# Altium project MB_ANALOG.PrjPCB
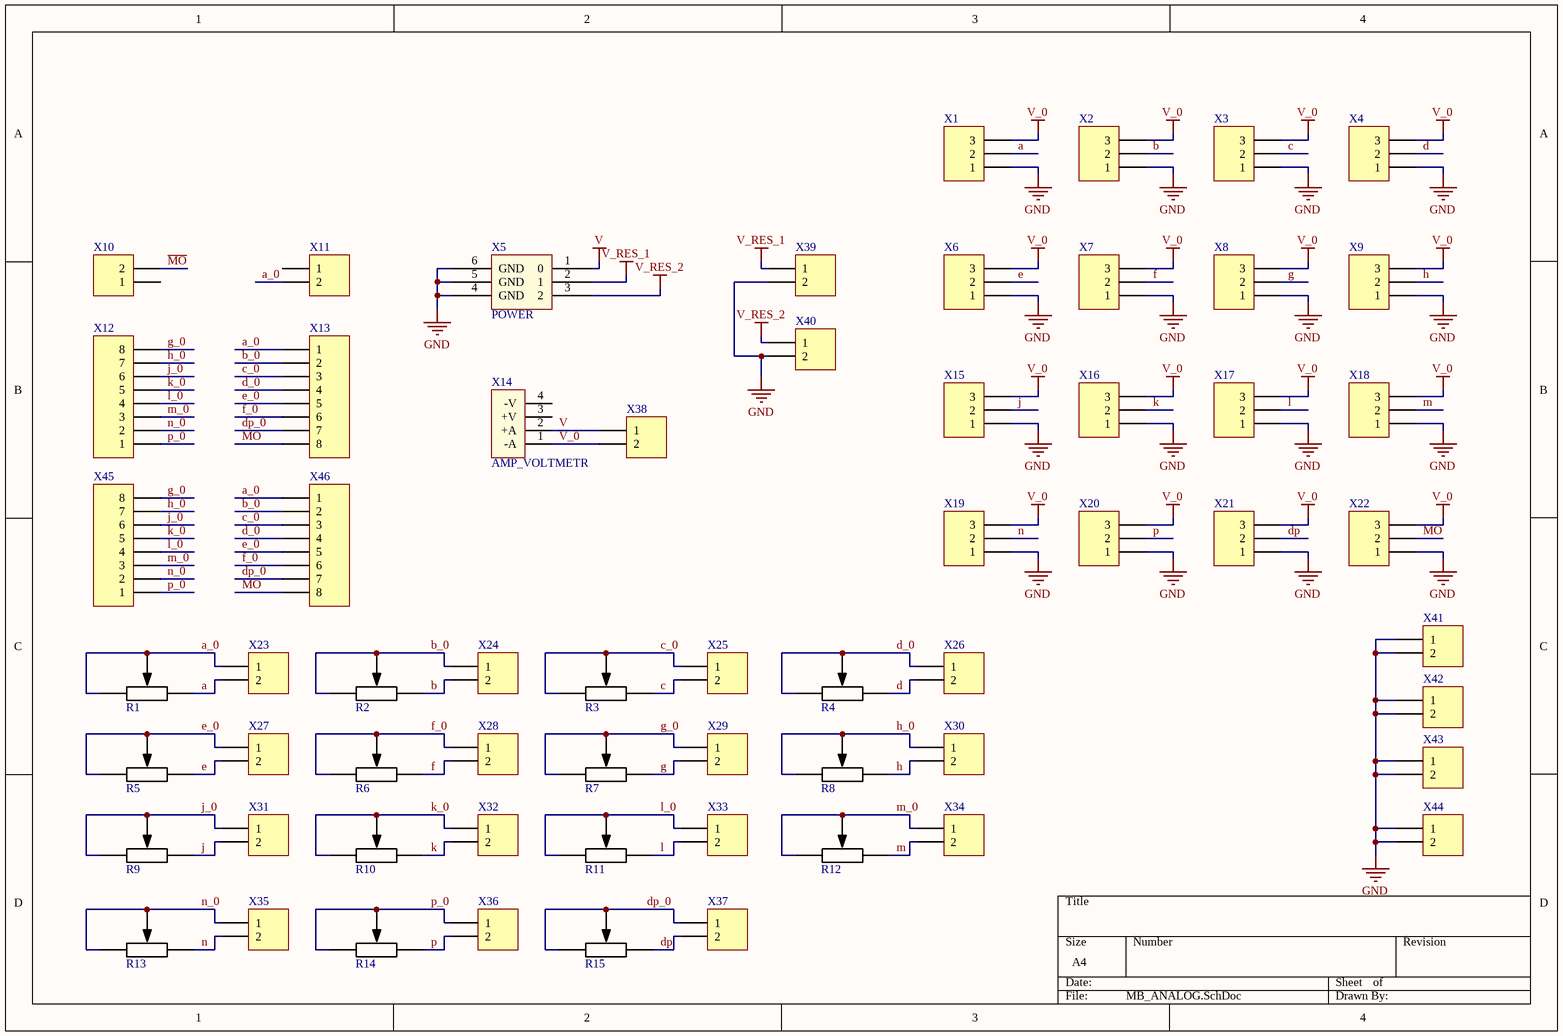
[diagram p0: MB_ANALOG.SchDoc]
1 sheet, 61 parts. Net scope: global (net labels, ports and power ports of the same name join across sheets).
Board file: MB_ANALOG.PcbDoc

## Sheet MB_ANALOG.SchDoc
size A4

### Parts
R1  RES 3266W  [RES 3266W]  (value not drawn)
R2  RES 3266W  [RES 3266W]  (value not drawn)
R3  RES 3266W  [RES 3266W]  (value not drawn)
R4  RES 3266W  [RES 3266W]  (value not drawn)
R5  RES 3266W  [RES 3266W]  (value not drawn)
R6  RES 3266W  [RES 3266W]  (value not drawn)
R7  RES 3266W  [RES 3266W]  (value not drawn)
R8  RES 3266W  [RES 3266W]  (value not drawn)
R9  RES 3266W  [RES 3266W]  (value not drawn)
R10  RES 3266W  [RES 3266W]  (value not drawn)
R11  RES 3266W  [RES 3266W]  (value not drawn)
R12  RES 3266W  [RES 3266W]  (value not drawn)
R13  RES 3266W  [RES 3266W]  (value not drawn)
R14  RES 3266W  [RES 3266W]  (value not drawn)
R15  RES 3266W  [RES 3266W]  (value not drawn)
X1  Header 3  [HDR1X3]  (value not drawn)
X2  Header 3  [HDR1X3]  (value not drawn)
X3  Header 3  [HDR1X3]  (value not drawn)
X4  Header 3  [HDR1X3]  (value not drawn)
X5  POWER  [POWER]
X6  Header 3  [HDR1X3]  (value not drawn)
X7  Header 3  [HDR1X3]  (value not drawn)
X8  Header 3  [HDR1X3]  (value not drawn)
X9  Header 3  [HDR1X3]  (value not drawn)
X10  Header 2  [HDR1X2]  (value not drawn)
X11  Header 2  [HDR1X2]  (value not drawn)
X12  Header 8  [HDR1X8]  (value not drawn)
X13  Header 8  [HDR1X8]  (value not drawn)
X14  AMP_VOLTMETR  [AMP_VOLTMETR]
X15  Header 3  [HDR1X3]  (value not drawn)
X16  Header 3  [HDR1X3]  (value not drawn)
X17  Header 3  [HDR1X3]  (value not drawn)
X18  Header 3  [HDR1X3]  (value not drawn)
X19  Header 3  [HDR1X3]  (value not drawn)
X20  Header 3  [HDR1X3]  (value not drawn)
X21  Header 3  [HDR1X3]  (value not drawn)
X22  Header 3  [HDR1X3]  (value not drawn)
X23  Header 2  [HDR1X2]  (value not drawn)
X24  Header 2  [HDR1X2]  (value not drawn)
X25  Header 2  [HDR1X2]  (value not drawn)
X26  Header 2  [HDR1X2]  (value not drawn)
X27  Header 2  [HDR1X2]  (value not drawn)
X28  Header 2  [HDR1X2]  (value not drawn)
X29  Header 2  [HDR1X2]  (value not drawn)
X30  Header 2  [HDR1X2]  (value not drawn)
X31  Header 2  [HDR1X2]  (value not drawn)
X32  Header 2  [HDR1X2]  (value not drawn)
X33  Header 2  [HDR1X2]  (value not drawn)
X34  Header 2  [HDR1X2]  (value not drawn)
X35  Header 2  [HDR1X2]  (value not drawn)
X36  Header 2  [HDR1X2]  (value not drawn)
X37  Header 2  [HDR1X2]  (value not drawn)
X38  Header 2  [HDR1X2]  (value not drawn)
X39  Header 2  [HDR1X2]  (value not drawn)
X40  Header 2  [HDR1X2]  (value not drawn)
X41  Header 2  [HDR1X2]  (value not drawn)
X42  Header 2  [HDR1X2]  (value not drawn)
X43  Header 2  [HDR1X2]  (value not drawn)
X44  Header 2  [HDR1X2]  (value not drawn)
X45  Header 8  [HDR1X8]  (value not drawn)
X46  Header 8  [HDR1X8]  (value not drawn)

### Nets
GND: X1.1 X2.1 X3.1 X4.1 X5.4(GND) X5.5(GND) X5.6(GND) X6.1 X7.1 X8.1 X9.1 X15.1 X16.1 X17.1 X18.1 X19.1 X20.1 X21.1 X22.1 X39.2 X40.2 X41.1 X41.2 X42.1 X42.2 X43.1 X43.2 X44.1 X44.2
V: X5.1(0) X14.2(+A) X38.1
V_0: X1.3 X2.3 X3.3 X4.3 X6.3 X7.3 X8.3 X9.3 X14.1(-A) X15.3 X16.3 X17.3 X18.3 X19.3 X20.3 X21.3 X22.3 X38.2
V_RES_1: X5.2(1) X39.1
V_RES_2: X5.3(2) X40.1
a: R1.3 X1.2 X23.2
a_0: R1.1 R1.2 X11.2 X13.1 X23.1 X46.1
b: R2.3 X2.2 X24.2
b_0: R2.1 R2.2 X13.2 X24.1 X46.2
c: R3.3 X3.2 X25.2
c_0: R3.1 R3.2 X13.3 X25.1 X46.3
d: R4.3 X4.2 X26.2
d_0: R4.1 R4.2 X13.4 X26.1 X46.4
dp: R15.3 X21.2 X37.2
dp_0: R15.1 R15.2 X13.7 X37.1 X46.7
e: R5.3 X6.2 X27.2
e_0: R5.1 R5.2 X13.5 X27.1 X46.5
f: R6.3 X7.2 X28.2
f_0: R6.1 R6.2 X13.6 X28.1 X46.6
g: R7.3 X8.2 X29.2
g_0: R7.1 R7.2 X12.8 X29.1 X45.8
h: R8.3 X9.2 X30.2
h_0: R8.1 R8.2 X12.7 X30.1 X45.7
j: R9.3 X15.2 X31.2
j_0: R9.1 R9.2 X12.6 X31.1 X45.6
k: R10.3 X16.2 X32.2
k_0: R10.1 R10.2 X12.5 X32.1 X45.5
l: R11.3 X17.2 X33.2
l_0: R11.1 R11.2 X12.4 X33.1 X45.4
m: R12.3 X18.2 X34.2
~{MO}: X10.2 X13.8 X22.2 X46.8
m_0: R12.1 R12.2 X12.3 X34.1 X45.3
n: R13.3 X19.2 X35.2
n_0: R13.1 R13.2 X12.2 X35.1 X45.2
p: R14.3 X20.2 X36.2
p_0: R14.1 R14.2 X12.1 X36.1 X45.1

Not connected (* = marked no-connect by the designer): X10 1; X11 1; X14 3(+V) 4(-V)

### Library data of the parts
X1-X4 X6-X9 X15-X22 = Header 3: Header, 3-Pin; LatestRevisionDate: 17-Jul-2002; LatestRevisionNote: Re-released for DXP Platform.; Publisher: Altium Limited
X10 X11 X23-X44 = Header 2: Header, 2-Pin; LatestRevisionDate: 17-Jul-2002; LatestRevisionNote: Re-released for DXP Platform.; Publisher: Altium Limited
X12 X13 X45 X46 = Header 8: Header, 8-Pin; LatestRevisionDate: 17-Jul-2002; LatestRevisionNote: Re-released for DXP Platform.; Publisher: Altium Limited